# EAGLE design batt-charger (EAGLE 6.2)
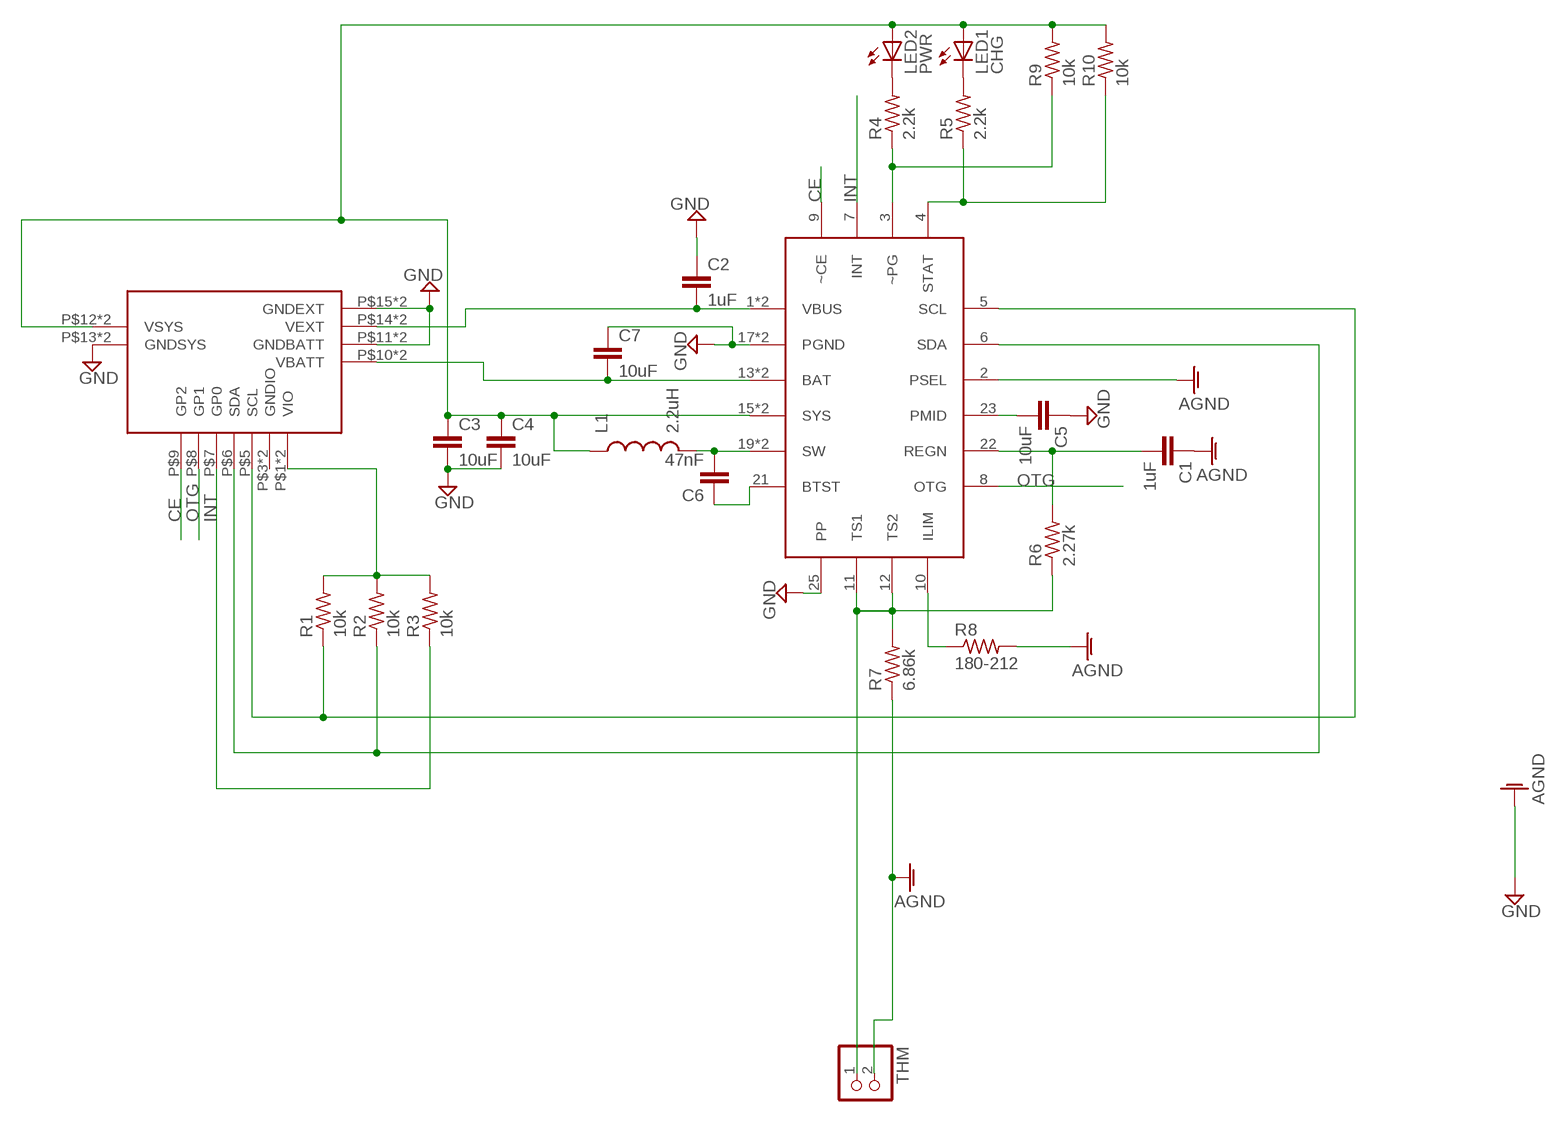
[diagram p0: schematic, sheet 1]

## Parts
C1  1uF  CAP0603-CAP  [0603-CAP]
C2  1uF  CAP0603-CAP  [0603-CAP]
C3  10uF  CAP1206  [1206]
C4  10uF  CAP1206  [1206]
C5  10uF  CAP1206  [1206]
C6  47nF  CAP0603-CAP  [0603-CAP]
C7  10uF  CAP1206  [1206]
L1  2.2uH  INDUCTOR-VISHAY-2020  [INDUCTOR-2020]
LED1  CHG  LEDCHIP-LED0603  [CHIP-LED0603]
LED2  PWR  LEDCHIP-LED0603  [CHIP-LED0603]
R1  10k  R-US_R0603  [R0603]
R2  10k  R-US_R0603  [R0603]
R3  10k  R-US_R0603  [R0603]
R4  2.2k  R-US_R0603  [R0603]
R5  2.2k  R-US_R0603  [R0603]
R6  2.27k  R-US_R0603  [R0603]
R7  6.86k  R-US_R0603  [R0603]
R8  180-212  R-US_R0603  [R0603]
R9  10k  R-US_R0603  [R0603]
R10  10k  R-US_R0603  [R0603]
THM  JST_2PIN-THM  [JST-PH-2-THM]
U$1  BQ24193  [QFN-400X400X100-25P]
U$2  G4-CHG-SOCKETSTD  [G4-CHG-SOCKET]

## Nets
AGND: C1.1 R7.1 R8.2 THM.2 U$1.2(PSEL)
CE: U$1.9(~CE) U$2.P$9(GP2)
GND: C2.1 C3.2 C4.2 C5.1 C7.1 U$1.17(PGND) U$1.18(PGND) U$1.25(PP) U$2.P$11(GNDBATT) U$2.P$13(GNDSYS) U$2.P$15(GNDEXT) U$2.P$17(GNDBATT) U$2.P$19(GNDSYS) U$2.P$21(GNDEXT) ; supply symbol labelled AGND
INT: R3.1 U$1.7(INT) U$2.P$7(GP0)
N$1: C6.2 L1.P$2 U$1.19(SW) U$1.20(SW)
N$2: R1.1 U$1.5(SCL) U$2.P$5(SCL)
N$3: R2.1 U$1.6(SDA) U$2.P$6(SDA)
N$4: C6.1 U$1.21(BTST)
N$6: LED2.C R4.2
N$7: LED1.C R5.2
N$8: R4.1 R9.1 U$1.3(~PG)
N$9: R5.1 R10.1 U$1.4(STAT)
N$10: C1.2 R6.2 U$1.22(REGN)
N$11: R6.1 R7.2 THM.1 U$1.11(TS1) U$1.12(TS2)
N$14: R8.1 U$1.10(ILIM)
N$15: C5.2 U$1.23(PMID)
OTG: U$1.8(OTG) U$2.P$8(GP1)
VBATT: C7.2 U$1.13(BAT) U$1.14(BAT) U$2.P$10(VBATT) U$2.P$16(VBATT)
VEXT: C2.2 U$1.1(VBUS) U$1.24(VBUS) U$2.P$14(VEXT) U$2.P$20(VEXT)
VIO: R1.2 R2.2 R3.2 U$2.P$1(VIO) U$2.P$2(VIO)
VSYS: C3.1 C4.1 L1.P$1 LED1.A LED2.A R9.2 R10.2 U$1.15(SYS) U$1.16(SYS) U$2.P$12(VSYS) U$2.P$18(VSYS)
Unconnected: U$2.P$3(GNDIO) U$2.P$4(GNDIO)

## Library data of the parts
C1-C7 = SparkFun-Capacitors:CAP: Capacitor Standard 0603 ceramic capacitor, and 0.1" leaded capacitor.
L1 = greg:INDUCTOR-VISHAY-2020
LED1 LED2 = adafruit:LED: LED OSRAM: - CHIPLED LG R971, LG N971, LY N971, LG Q971, LY Q971, LO R971, LY R971 LH N974, LH R974 LS Q976, LO Q976, LY Q976 LO Q996 - Hyper CHIPLED LW Q18S LB Q993, LB Q99A, LB R99A - SideLED LS A670, LO A670, LY A670, LG A670, LP A670 LB A673, LV A673, LT A673, LW A673 LH A674 LY A675 LS A676, LA A676, LO A676, LY A676, LW A676 LS A679, LY A679, LG A679 - Hyper Micro SIDELED® LS Y876, LA Y876, LO Y876, LY Y876 LT Y87S - SmartLED LW L88C, LW L88S LB L89C, LB L89S, LG L890 LS L89K, LO L89K, LY L89K LS L896, LA L896, LO L896, LY L896 - TOPLED LS T670, LO T670, LY T670, LG T670, LP T670 LSG T670, LSP T670, LSY T670, LOP T670, LYG T670 LG T671, LOG T671, LSG T671 LB T673, LV T673, LT T673, LW T673 LH T674 LS T676, LA T676, LO T676, LY T676, LB T676, LH T676, LSB T676, LW T676 LB T67C, LV T67C, LT T67C, LS T67K, LO T67K, LY T67K, LW E67C LS E67B, LA E67B, LO E67B, LY E67B, LB E67C, LV E67C, LT E67C LW T67C LS T679, LY T679, LG T679 LS T770, LO T770, LY T770, LG T770, LP T770 LB T773, LV T773, LT T773, LW T773 LH T774 LS E675, LA E675, LY E675, LS T675 LS T776, LA T776, LO T776, LY T776, LB T776 LHGB T686 LT T68C, LB T68C - Hyper Mini TOPLED® LB M676 - Mini TOPLED Santana® LG M470 LS M47K, LO M47K, LY M47K Source: http://www.osram.convergy.de/
R1-R10 = adafruit:R-US_: RESISTOR, American symbol
THM = adafruit:JST_2PIN: JST 2-Pin Connectors of various flavors SMT-RA (S2B-PH-SM4) 4UConnector #17311 SMT (B2B-PH-SM4) THM-RA (S2B-PH) THM (B2B-PH)
U$1 = greg:BQ24193
U$2 = greg:G4-CHG-SOCKET

## Board
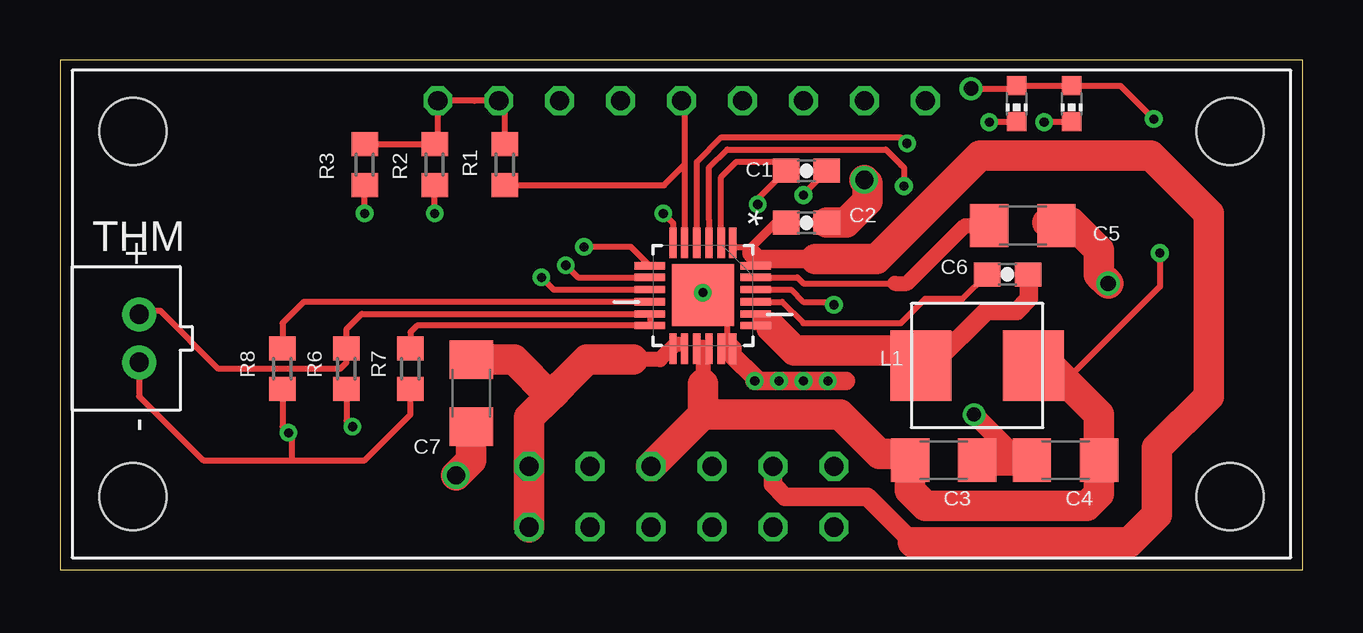
[diagram p1: board, top side]
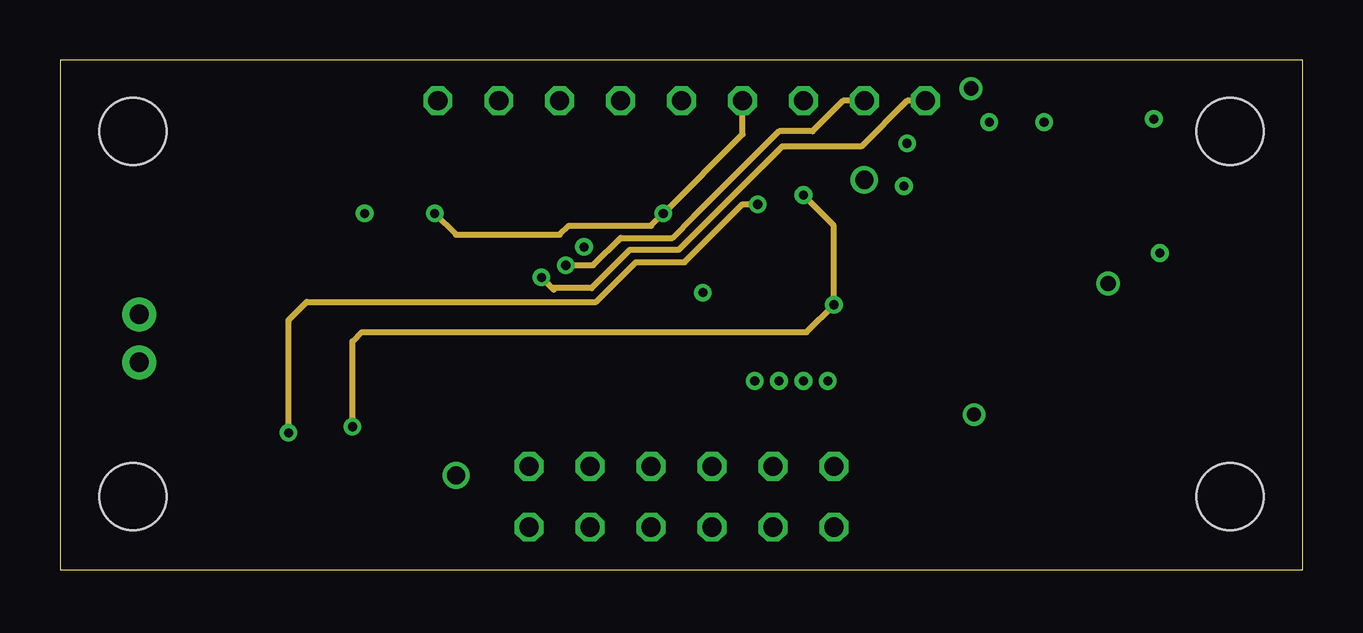
[diagram p2: board, inner layer Route2]
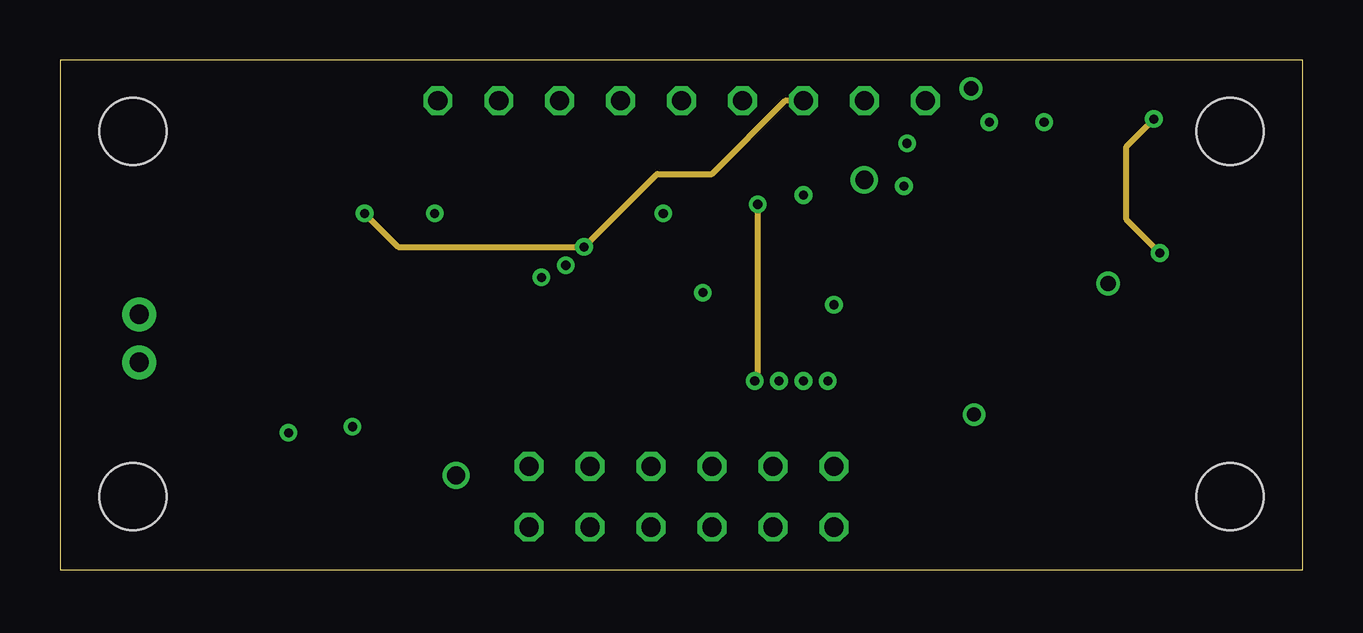
[diagram p3: board, inner layer Route3]
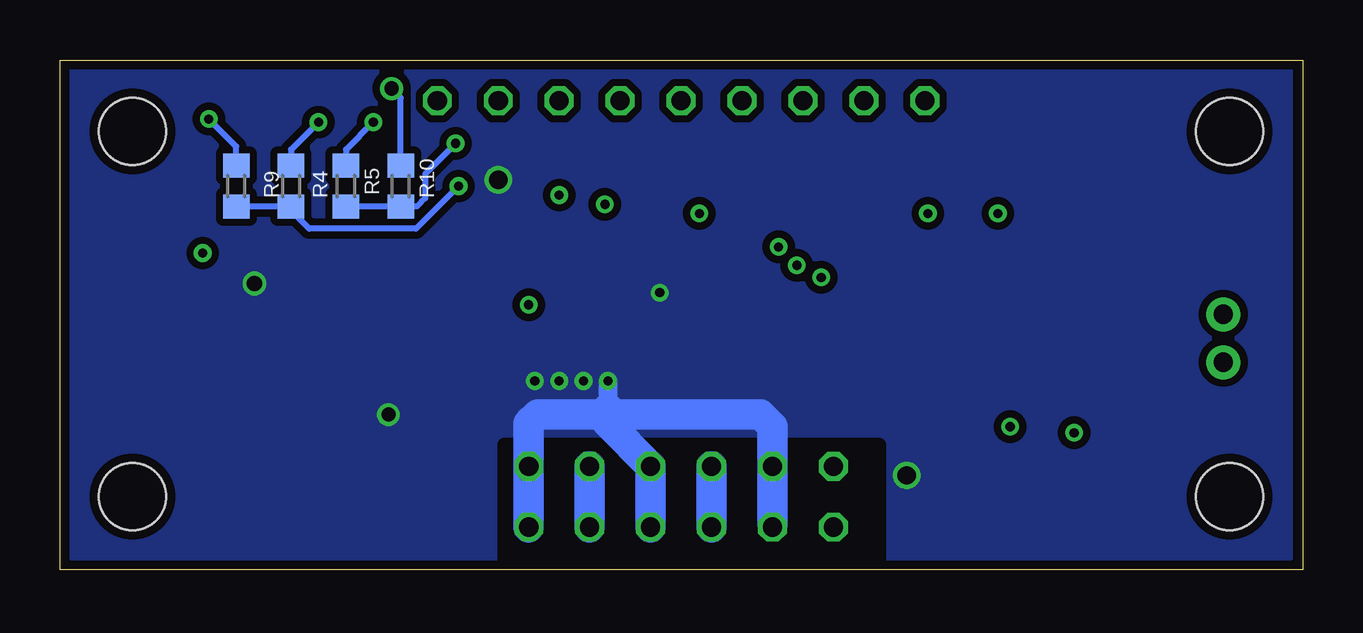
[diagram p4: board, bottom side, seen from below]

Size 51.8 x 21.26 mm. Coordinates in mm from the lower left corner, seen from the top.
Outline: 0,0 51.8,0 51.8,21.26 0,21.26 0,0
Copper layers (1*2*3*16): Top 0.0356mm / dielectric 1.5011mm / Route2 0.0356mm / dielectric 0.1499mm / Route3 0.0356mm / dielectric 0.2007mm / Bottom 0.0356mm
Design rules: minimum track width 6mil, minimum drill 13mil, track to track 6mil, track to pad 6mil, pad to pad 6mil, via to via 6mil, smd to smd 6mil, copper to edge 15mil, drill to drill 6mil, minimum pad ring 7mil, minimum via ring 7mil, stop-mask expansion 4mil, vias tented up to drill 0mil, thermal gap 10mil
bRestrict: area 17.7,0.6 to 33.3,5.2

### Footprints (pad centres in the part's own frame; a part is rotated, then mirrored left to right if it is on the bottom)
0603-CAP = smd 1.1 x 1: 1 -0.85,0; 2 0.85,0
1206 = smd 1.6 x 1.8: 1 -1.4,0; 2 1.4,0
INDUCTOR-2020 = smd 2.54 x 2.921: P$1 -2.349,0; P$2 2.349,0
CHIP-LED0603 = smd 0.8 x 0.8: A 0,-0.75; C 0,0.75
R0603 = smd 1 x 1.1: 1 -0.85,0; 2 0.85,0
JST-PH-2-THM = drill 0.8 pad 1.422: 1 1,0; 2 -1,0
QFN-400X400X100-25P = smd 1.27 x 0.305: 1 -2.21,1.245; 2 -2.21,0.762; 3 -2.21,0.254; 4 -2.21,-0.254; 5 -2.21,-0.762; 6 -2.21,-1.245; 13 2.21,-1.245; 14 2.21,-0.762; 15 2.21,-0.254; 16 2.21,0.254; 17 2.21,0.762; 18 2.21,1.245 | smd 0.305 x 1.27: 7 -1.245,-2.21; 8 -0.762,-2.21; 9 -0.254,-2.21; 10 0.254,-2.21; 11 0.762,-2.21; 12 1.245,-2.21; 19 1.245,2.21; 20 0.762,2.21; 21 0.254,2.21; 22 -0.254,2.21; 23 -0.762,2.21; 24 -1.245,2.21 | smd 2.591 x 2.591: 25 -0.025,0
G4-CHG-SOCKET = drill 0.8 octagon: P$1 -10.16,8.89; P$2 -7.62,8.89; P$3 -5.08,8.89; P$4 -2.54,8.89; P$5 0,8.89; P$6 2.54,8.89; P$7 5.08,8.89; P$8 7.62,8.89; P$9 10.16,8.89; P$10 -6.35,-8.89; P$11 -3.81,-8.89; P$12 -1.27,-8.89; P$13 1.27,-8.89; P$14 3.81,-8.89; P$15 6.35,-8.89; P$16 -6.35,-6.35; P$17 -3.81,-6.35; P$18 -1.27,-6.35; P$19 1.27,-6.35; P$20 3.81,-6.35; P$21 6.35,-6.35 | hole 2.8: -22.86,7.62; 22.86,-7.62; -22.86,-7.62; 22.86,7.62

### Placement (x,y rotation side)
C1  31.11,16.64 0 top
C2  31.11,14.48 180 top
C3  36.83,4.57 0 top
C4  41.91,4.57 180 top
C5  40.13,14.35 180 top
C6  39.5,12.32 0 top
C7  17.14,7.37 90 top
L1  38.23,8.51 180 top
LED1  39.88,19.43 180 top
LED2  42.16,19.43 180 top
R1  18.54,16.89 90 top
R2  15.62,16.89 90 top
R3  12.7,16.89 90 top
R4  42.16,16 90 bottom
R5  39.88,16 90 bottom
R6  11.94,8.38 270 top
R7  14.61,8.38 90 top
R8  9.27,8.38 270 top
R9  44.45,16 90 bottom
R10  37.59,16 90 bottom
THM  3.3,9.65 90 top
U$1  26.8,11.43 270 top
U$2  25.91,10.67 0 top

### Tracks (layer width: path | path; a pad name or v marks a point on that pad's centre or on a via)
AGND  (via drill 0.38)
  Top 0.254: U$1.2 27.56,16.38 28.19,17.02 29.38,17.02 29.88,17.02 C1.1 29.08,15.45 v29.08,15.24 | R8.2 9.27,5.97 v9.53,5.71 9.65,5.71 9.65,4.57 | THM.2 3.3,7.24 5.97,4.57 9.65,4.57 | 9.65,4.57 12.7,4.57 14.61,6.48 R7.1
  Route2 0.254: v9.53,5.71 9.53,10.41 10.29,11.18 22.35,11.18 24,12.83 26.03,12.83 28.45,15.24 v29.08,15.24
CE  (via drill 0.38)
  Top 0.254: U$1.9 20.57,11.68 v20.07,12.19
  Route2 0.254: U$2.P$9 35.31,19.56 33.4,17.65 30.35,17.65 30.1,17.65 25.78,13.34 23.75,13.34 22.16,11.75 20.51,11.75 | 20.57,11.68 20.51,11.75 | 20.51,11.75 v20.07,12.19
GND  (via drill 0.38, 0.58, 0.64, 0.76)
  Top 0.152: 41.15,14.48 C5.1
  Top 0.254: U$1.18 U$1.17 27.81,9.47 27.81,11.05 27.41,11.45 U$1.25
  Top 0.762: 32.77,7.87 v32,7.87 v30.99,7.87 v29.97,7.87 v28.96,7.87 28.98,8 28.04,8.94 U$1.18 | 40,4.57 v38.1,6.48
  Top 1.27: C3.2 40,4.57 C4.2 | v33.53,16.26 33.66,16.13 33.66,15.37 32.77,14.48 C2.1 | C7.1 17.14,4.57 v16.51,3.94 | 41.15,14.48 42.16,14.48 43.31,13.34 43.31,12.32 v43.69,11.94
  Route3 0.254: 29.08,15.24 29.08,8 v28.96,7.87
  Bottom 0.762: 28.96,6.73 v28.96,7.87
  Bottom 1.27: 22.1,1.91 U$2.P$17 22.1,5.97 22.61,6.48 28.96,6.48 | U$2.P$15 U$2.P$21 32.26,6.1 31.88,6.48 28.96,6.48 | 28.96,6.48 28.96,6.73 28.96,6.1 U$2.P$19 U$2.P$13
  other vias: 26.8,11.56
  pour Bottom (isolate 0.305): 0.51,20.83 51.31,20.83 51.31,0.51 0.51,0.51
INT  (via drill 0.38)
  Top 0.254: v12.7,14.86 R3.1 | U$1.7 23.8,13.46 v21.84,13.46
  Route3 0.254: U$2.P$7 30.23,19.56 27.18,16.51 24.89,16.51 v21.84,13.46 14.1,13.46 v12.7,14.86
N$1
  Top 0.254: U$1.20 U$1.19
  Top 0.381: U$1.19 29.36,10.54 29.46,10.54 29.46,10.29
  Top 0.635: 36.41,8.51 L1.P$2
  Top 0.762: 29.46,10.29 29.65,10.1 29.84,9.91 29.97,9.78 | 36.41,8.51 36.41,8.6 38.61,10.79 39.88,10.79 40.39,11.3 40.39,12.41 C6.2
  Top 1.27: 29.65,10.1 30.61,9.14 35.24,9.14 L1.P$2
N$2
  Top 0.254: U$2.P$5 26.03,19.43 26.03,16.89 | 26.03,16.89 U$1.5 | R1.1 25.19,16.04 26.03,16.89
N$3  (via drill 0.38)
  Top 0.254: v25.15,14.86 25.55,14.45 U$1.6 | v15.62,14.86 R2.1
  Route2 0.254: v15.62,14.86 16.51,13.97 20.83,13.97 21.21,14.35 24.64,14.35 v25.15,14.86 28.45,18.16 U$2.P$6
N$4
  Top 0.254: U$1.21 30.1,11.18 30.99,10.29 34.16,10.29 35.05,10.29 36.07,11.3 37.63,11.3 C6.1
N$6  (via drill 0.38)
  Top 0.254: LED2.C 42.15,18.67 v41.02,18.67
  Bottom 0.254: v41.02,18.67 42.16,17.53 R4.2
N$7  (via drill 0.38)
  Top 0.254: LED1.C 39.87,18.67 v38.73,18.67
  Bottom 0.254: v38.73,18.67 39.88,17.53 R5.2
N$8  (via drill 0.38)
  Top 0.254: U$1.3 27.05,14.6 27.05,16.76 27.81,17.53 34.42,17.53 35.05,16.89 35.18,16.76 v35.18,16
  Bottom 0.254: v35.18,16 36.96,14.22 41.4,14.22 42.16,14.99 R4.1 R9.1
N$9  (via drill 0.38)
  Top 0.254: U$1.4 26.54,17.02 27.56,18.03 34.92,18.03 35.05,18.03 v35.31,17.78
  Bottom 0.254: 37.55,15.11 R10.1 | v35.31,17.78 36.58,16.51 36.58,15.49 36.92,15.15 R10.1 | R10.1 R5.1
N$10  (via drill 0.38)
  Top 0.254: U$1.22 30.48,11.68 30.99,11.18 32.13,11.18 v32.26,11.05 | v30.99,15.62 30.99,15.66 C1.2 | R6.2 11.94,6.22 v12.19,5.97
  Route2 0.254: v30.99,15.62 32.26,14.35 v32.26,11.05 31.11,9.91 12.57,9.91 12.19,9.52 v12.19,5.97
N$11
  Top 0.254: THM.1 3.45,10.79 4.19,10.79 6.6,8.38 11.68,8.38 11.94,8.64 R6.1 11.94,10.03 12.57,10.67 U$1.11 U$1.12 14.88,10.18 14.61,9.91 R7.2
N$14
  Top 0.254: U$1.10 10.16,11.18 9.27,10.29 R8.1
N$15
  Top 0.254: U$1.23 30.73,12.19 30.99,11.94 34.8,11.94
  Top 0.635: 34.8,11.94 35.31,11.94 37.72,14.35 C5.2
OTG  (via drill 0.38)
  Top 0.254: U$1.8 21.59,12.19 v21.08,12.7
  Route2 0.254: U$2.P$8 32.64,19.56 31.37,18.29 29.97,18.29 26.42,14.73 25.53,13.84 23.37,13.84 22.22,12.7 v21.08,12.7
VBATT
  Top 0.254: U$1.14 U$1.13 25.73,9.45 25.78,9.4
  Top 0.635: 25.78,9.4 25.65,9.4 25.02,8.76 23.88,8.76 23.75,8.76
  Top 1.27: U$2.P$10 U$2.P$16 19.56,6.35 20.45,7.24 | 20.45,7.24 20.95,7.75 21.97,8.76 23.88,8.76 | C7.2 18.92,8.77 20.45,7.24
VEXT
  Top 0.254: U$1.24 28.83,12.73 28.83,13.21 28.83,13.46 28.09,13.46 U$1.1
  Top 0.381: C2.2 29.84,14.48 28.83,13.46
  Top 0.762: U$2.P$20 29.72,3.56 30.23,3.05 33.66,3.05 35.56,1.14 | 31.5,12.95 29.08,12.95 28.83,13.21
  Top 1.27: 35.56,1.14 44.58,1.14 45.72,2.29 45.72,5.08 47.88,7.24 47.88,14.86 45.47,17.27 38.35,17.27 34.04,12.95 31.5,12.95
  Bottom 1.27: U$2.P$20 U$2.P$14
VIO
  Top 0.254: R1.2 18.54,19.3 U$2.P$2 17.27,19.56 U$2.P$1 15.75,17.87 R2.2 R3.2
VSYS  (via drill 0.38, 0.6)
  Top 0.254: U$1.15 U$1.16 26.97,9.45 26.8,9.27 | v45.59,18.8 44.21,20.18 LED2.A LED1.A 39.76,20.07 v37.97,20.07 | v45.85,13.21 45.85,11.81 41.91,7.87
  Top 0.635: 26.8,9.27 26.8,7.75
  Top 1.27: U$2.P$18 26.8,6.48 | 26.8,6.48 26.8,7.75 | 26.8,6.48 32.51,6.48 34.16,4.83 35.18,4.83 C3.1 35.43,3.3 36.07,2.67 42.8,2.67 43.31,3.17 43.31,4.06 C4.1 43.31,6.48 41.91,7.87 41.28,8.51 L1.P$1
  Route3 0.254: v45.85,13.21 44.45,14.6 44.45,17.65 v45.59,18.8 45.35,18.8
  Bottom 0.254: R9.2 44.45,17.65 v45.59,18.8 | R10.2 37.59,19.68 v37.97,20.07
  Bottom 1.27: U$2.P$12 U$2.P$18